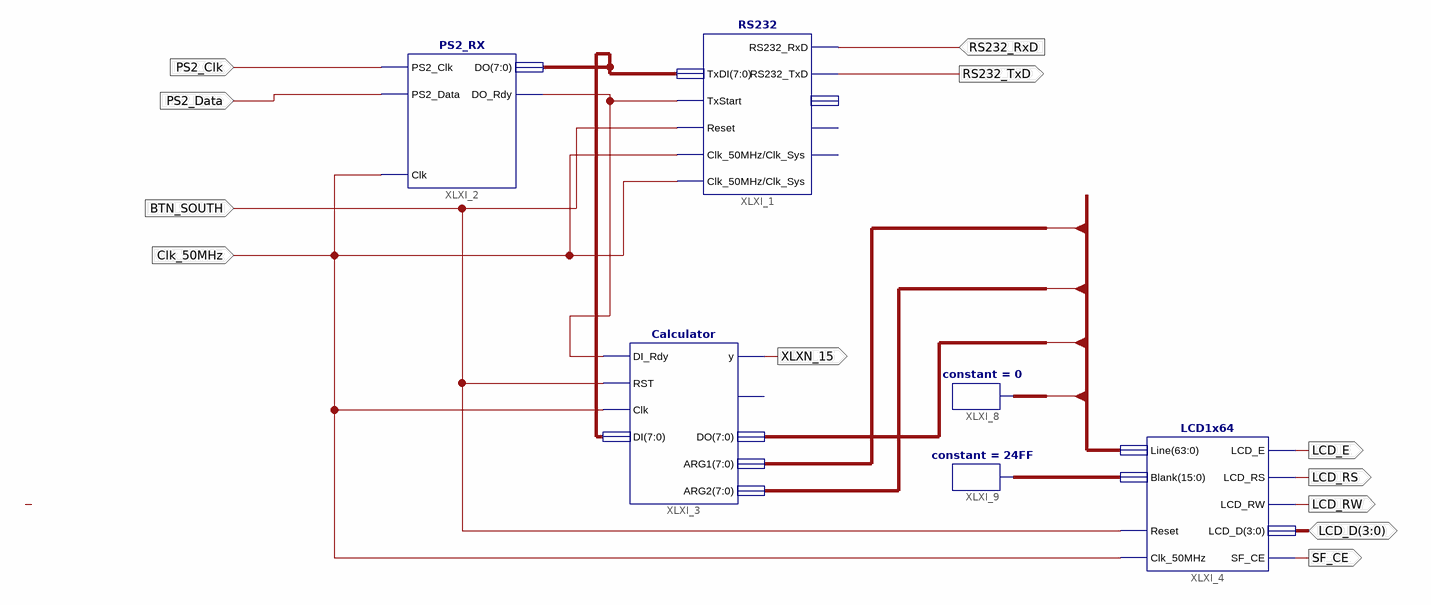
[diagram p0: schematic sheet 1]
// Xilinx ISE schematic hardware_test.sch (spartan3e) as structural Verilog: 6 symbols, 12 ports
module hardware_test (
  input  RS232_RxD,
  input  PS2_Clk,
  input  PS2_Data,
  input  BTN_SOUTH,
  input  Clk_50MHz,
  inout  [3:0] LCD_D,
  output RS232_TxD,
  output XLXN_15,
  output SF_CE,
  output LCD_RW,
  output LCD_RS,
  output LCD_E
);

  wire XLXN_4;
  wire [7:0] XLXN_3;
  wire [15:0] XLXN_40;
  wire [63:0] aaa;

  RS232 XLXI_1 (
    .Clk_50MHz(Clk_50MHz), .Reset(BTN_SOUTH), .RS232_RxD(RS232_RxD), .TxStart(XLXN_4), .TxDI(XLXN_3),
    .RS232_TxD(RS232_TxD), .Clk_Sys(Clk_50MHz));  // open: TxBusy, RxRdy, RxDO
  PS2_RX XLXI_2 (.PS2_Clk(PS2_Clk), .PS2_Data(PS2_Data), .DO_Rdy(XLXN_4), .DO(XLXN_3), .Clk(Clk_50MHz));
  Calculator XLXI_3 (
    .DI_Rdy(XLXN_4), .RST(BTN_SOUTH), .Clk(Clk_50MHz), .DI(XLXN_3), .y(XLXN_15), .ARG1(aaa[63:56]),
    .ARG2(aaa[51:44]), .DO(aaa[39:32]));  // open: DO_Rdy
  LCD1x64 XLXI_4 (
    .Clk_50MHz(Clk_50MHz), .Reset(BTN_SOUTH), .Line(aaa), .Blank(XLXN_40), .LCD_D(LCD_D), .LCD_E(LCD_E),
    .LCD_RW(LCD_RW), .LCD_RS(LCD_RS), .SF_CE(SF_CE));
  constant #(.CValue("0")) XLXI_8 (.O(aaa[31:0]));
  constant #(.CValue("24FF")) XLXI_9 (.O(XLXN_40));
endmodule
